# EAGLE schematic Met (EAGLE 9.5.1)
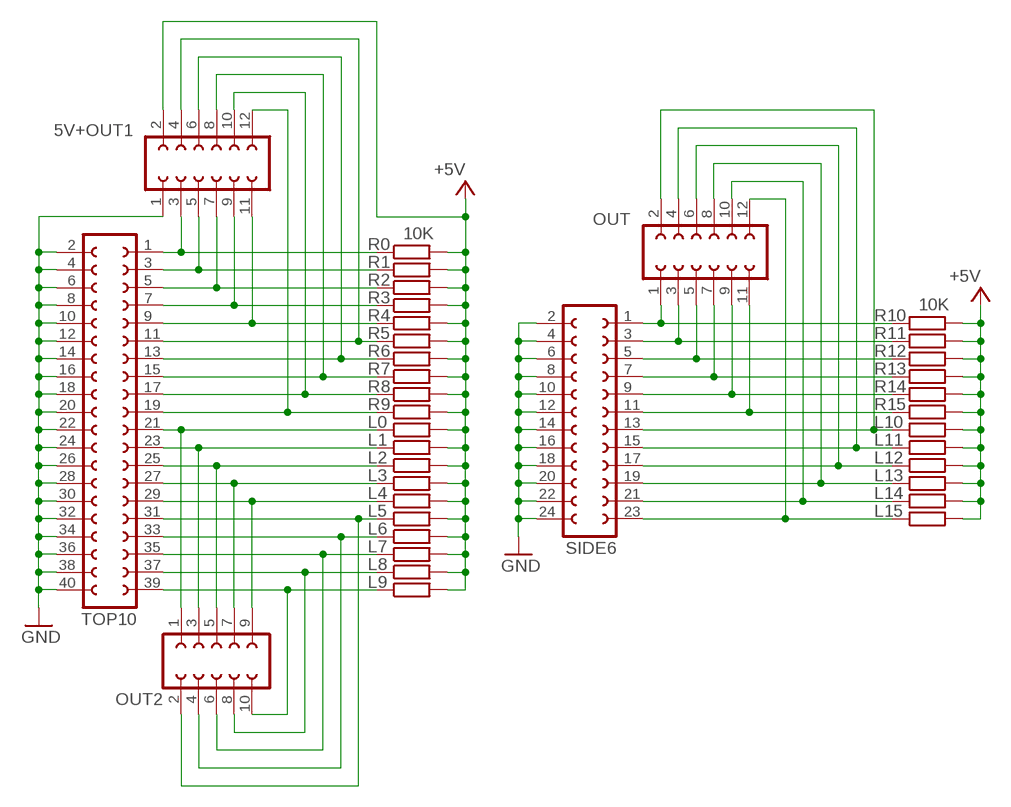
[diagram p0: schematic, sheet 1]

## Parts
5V+OUT1  FE06-2  [FE06-2]
L0  R-EU_0207/10  [0207/10]
L1  R-EU_0207/10  [0207/10]
L2  R-EU_0207/10  [0207/10]
L3  R-EU_0207/10  [0207/10]
L4  R-EU_0207/10  [0207/10]
L5  R-EU_0207/10  [0207/10]
L6  R-EU_0207/10  [0207/10]
L7  R-EU_0207/10  [0207/10]
L8  R-EU_0207/10  [0207/10]
L9  R-EU_0207/10  [0207/10]
L10  R-EU_0207/10  [0207/10]
L11  R-EU_0207/10  [0207/10]
L12  R-EU_0207/10  [0207/10]
L13  R-EU_0207/10  [0207/10]
L14  R-EU_0207/10  [0207/10]
L15  R-EU_0207/10  [0207/10]
OUT  FE06-2  [FE06-2]
OUT2  FE05-2  [FE05-2]
R0  10K  R-EU_0207/10  [0207/10]
R1  R-EU_0207/10  [0207/10]
R2  R-EU_0207/10  [0207/10]
R3  R-EU_0207/10  [0207/10]
R4  R-EU_0207/10  [0207/10]
R5  R-EU_0207/10  [0207/10]
R6  R-EU_0207/10  [0207/10]
R7  R-EU_0207/10  [0207/10]
R8  R-EU_0207/10  [0207/10]
R9  R-EU_0207/10  [0207/10]
R10  10K  R-EU_0207/10  [0207/10]
R11  R-EU_0207/10  [0207/10]
R12  R-EU_0207/10  [0207/10]
R13  R-EU_0207/10  [0207/10]
R14  R-EU_0207/10  [0207/10]
R15  R-EU_0207/10  [0207/10]
SIDE6  FE12-2  [FE12-2]
TOP10  FE20-2  [FE20-2]

## Nets
+5V: 5V+OUT1.2 L0.2 L1.2 L2.2 L3.2 L4.2 L5.2 L6.2 L7.2 L8.2 L9.2 L10.2 L11.2 L12.2 L13.2 L14.2 L15.2 R0.2 R1.2 R2.2 R3.2 R4.2 R5.2 R6.2 R7.2 R8.2 R9.2 R10.2 R11.2 R12.2 R13.2 R14.2 R15.2
GND: 5V+OUT1.1 SIDE6.2 SIDE6.4 SIDE6.6 SIDE6.8 SIDE6.10 SIDE6.12 SIDE6.14 SIDE6.16 SIDE6.18 SIDE6.20 SIDE6.22 SIDE6.24 TOP10.2 TOP10.4 TOP10.6 TOP10.8 TOP10.10 TOP10.12 TOP10.14 TOP10.16 TOP10.18 TOP10.20 TOP10.22 TOP10.24 TOP10.26 TOP10.28 TOP10.30 TOP10.32 TOP10.34 TOP10.36 TOP10.38 TOP10.40
N$1: 5V+OUT1.7 R2.1 TOP10.5
N$2: 5V+OUT1.8 R7.1 TOP10.15
N$3: 5V+OUT1.6 R6.1 TOP10.13
N$4: 5V+OUT1.4 R5.1 TOP10.11
N$5: 5V+OUT1.3 R0.1 TOP10.1
N$6: 5V+OUT1.5 R1.1 TOP10.3
N$7: 5V+OUT1.9 R3.1 TOP10.7
N$8: 5V+OUT1.11 R4.1 TOP10.9
N$9: OUT.5 R12.1 SIDE6.5
N$10: L12.1 OUT.6 SIDE6.17
N$11: 5V+OUT1.10 R8.1 TOP10.17
N$12: OUT.3 R11.1 SIDE6.3
N$13: L0.1 OUT2.1 TOP10.21
N$14: L1.1 OUT2.3 TOP10.23
N$15: L3.1 OUT2.7 TOP10.27
N$16: L4.1 OUT2.9 TOP10.29
N$17: L5.1 OUT2.2 TOP10.31
N$18: L6.1 OUT2.4 TOP10.33
N$19: L7.1 OUT2.6 TOP10.35
N$20: L8.1 OUT2.8 TOP10.37
N$23: L2.1 OUT2.5 TOP10.25
N$24: 5V+OUT1.12 R9.1 TOP10.19
N$27: L9.1 OUT2.10 TOP10.39
N$29: OUT.1 R10.1 SIDE6.1
N$30: OUT.7 R13.1 SIDE6.7
N$31: OUT.9 R14.1 SIDE6.9
N$32: OUT.11 R15.1 SIDE6.11
N$33: L10.1 OUT.2 SIDE6.13
N$34: L11.1 OUT.4 SIDE6.15
N$35: L13.1 OUT.8 SIDE6.19
N$36: L14.1 OUT.10 SIDE6.21
N$37: L15.1 OUT.12 SIDE6.23

## Library data of the parts
5V+OUT1 OUT = con-lsta:FE06-2: FEMALE HEADER; OC_FARNELL: unknown; OC_NEWARK: unknown
L0 L1-L15 R0 R1-R15 = rcl:R-EU_: RESISTOR, European symbol; SPICEPREFIX: R
OUT2 = con-lsta:FE05-2: FEMALE HEADER; OC_FARNELL: unknown; OC_NEWARK: unknown
SIDE6 = con-lsta:FE12-2: FEMALE HEADER; OC_FARNELL: unknown; OC_NEWARK: unknown
TOP10 = con-lsta:FE20-2: FEMALE HEADER; OC_FARNELL: unknown; OC_NEWARK: unknown